# Altium schematic sheet EconetTerminator.SchDoc
size A4; SheetNumber: 1; SheetTotal: 1
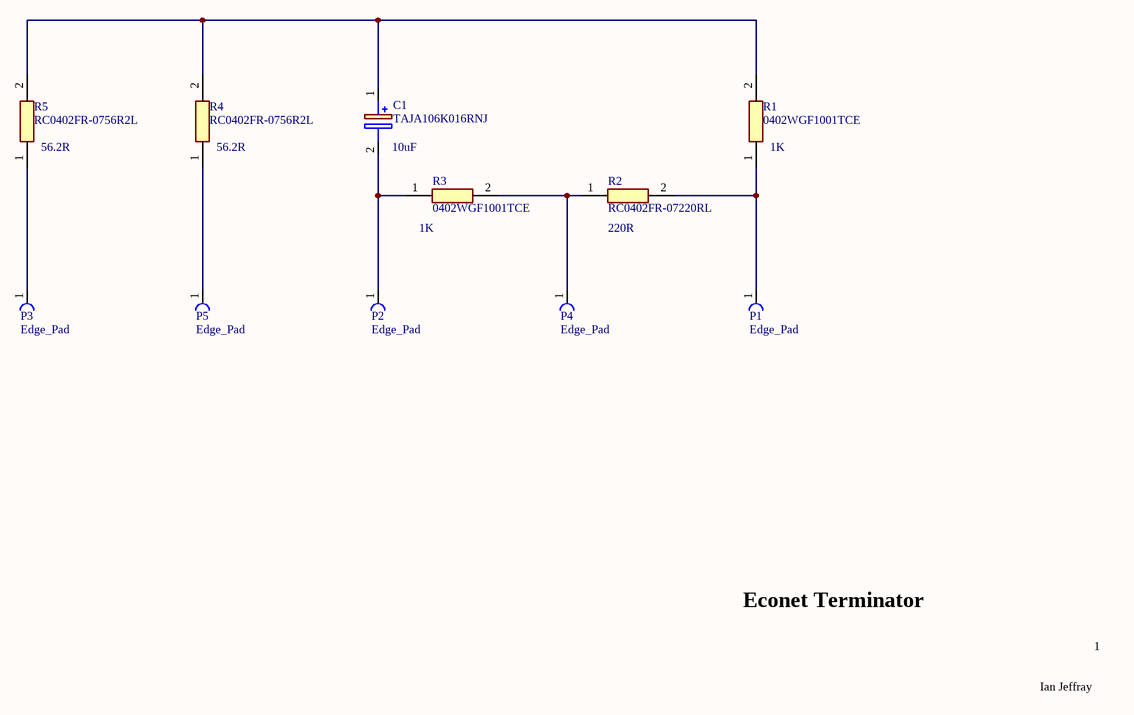
[diagram p0: EconetTerminator.SchDoc]

## Parts
C1  TAJA106K016RNJ  value 10uF  [CAPPM3216X180N]
P1  Edge_Pad  [CONS_PAD]  (no BOM)
P2  Edge_Pad  [CONS_PAD]  (no BOM)
P3  Edge_Pad  [CONS_PAD]  (no BOM)
P4  Edge_Pad  [CONS_PAD]  (no BOM)
P5  Edge_Pad  [CONS_PAD]  (no BOM)
R1  0402WGF1001TCE  value 1K  [RESC1005X40N]
R2  RC0402FR-07220RL  value 220R  [RESC1005X40N]
R3  0402WGF1001TCE  value 1K  [RESC1005X40N]
R4  RC0402FR-0756R2L  value 56.2R  [RESC1005X40N]
R5  RC0402FR-0756R2L  value 56.2R  [RESC1005X40N]

## Nets
NetC1_1: C1.1(+) R1.2 R4.2 R5.2
NetC1_2: C1.2(-) P2.1 R3.1
NetP1_1: P1.1 R1.1 R2.2
NetP3_1: P3.1 R5.1
NetP4_1: P4.1 R2.1 R3.2
NetP5_1: P5.1 R4.1

## Notes on the sheet
- Econet Terminator
- 1
- Ian Jeffray

## Library data of the parts
C1 = TAJA106K016RNJ: 10uF Tantalum; Manufacturer_Name: AVX; Datasheet Link: http://www.farnell.com/datasheets/1680476.pdf; Height: 1.8mm; Manufacturer_Part_Number: TAJA106K016RNJ; Mouser Part Number: 581-TAJA106K016R; Mouser Price/Stock: https://www.mouser.co.uk/ProductDetail/AVX/TAJA106K016RNJ?qs=OVpPYgiJXXV05Cvf2fCYWQ%3D%3D; Arrow Part Number: TAJA106K016RNJ; Arrow Price/Stock: https://www.arrow.com/en/products/taja106k016rnj/avx
P1-P5 = Edge_Pad: Edge Pad
R1 R3 = 0402WGF1001TCE: Resistor 1K; Manufacturer_Name: UNI-ROYAL(Uniroyal Elec); Datasheet Link: https://datasheet.lcsc.com/szlcsc/Uniroyal-Elec-0402WGF1001TCE_C11702.pdf; Height: 0.4mm; Manufacturer_Part_Number: 0402WGF1001TCE
R2 = RC0402FR-07220RL: Resistor 220R; Manufacturer_Name: KEMET; Datasheet Link: https://datasheet.datasheetarchive.com/originals/distributors/Datasheets_SAMA/902f9e387b938f871d31120f5fc1d65e.pdf; Height: 0.4mm; Manufacturer_Part_Number: RC0402FR-07220RL; Mouser Part Number: 603-RC0402FR-07220RL; Mouser Price/Stock: https://www.mouser.co.uk/ProductDetail/YAGEO/RC0402FR-07220RL?qs=UOUeRUa%252B8Wkw9iNOZEwgHw%3D%3D; Arrow Part Number: RC0402FR-07220RL; Arrow Price/Stock: https://www.arrow.com/en/products/rc0402fr-07220rl/yageo?region=nac
R4 R5 = RC0402FR-0756R2L: Resistor 56R2; Manufacturer_Name: KEMET; Datasheet Link: https://datasheet.datasheetarchive.com/originals/distributors/Datasheets_SAMA/902f9e387b938f871d31120f5fc1d65e.pdf; Height: 0.4mm; Manufacturer_Part_Number: RC0402FR-0756R2L